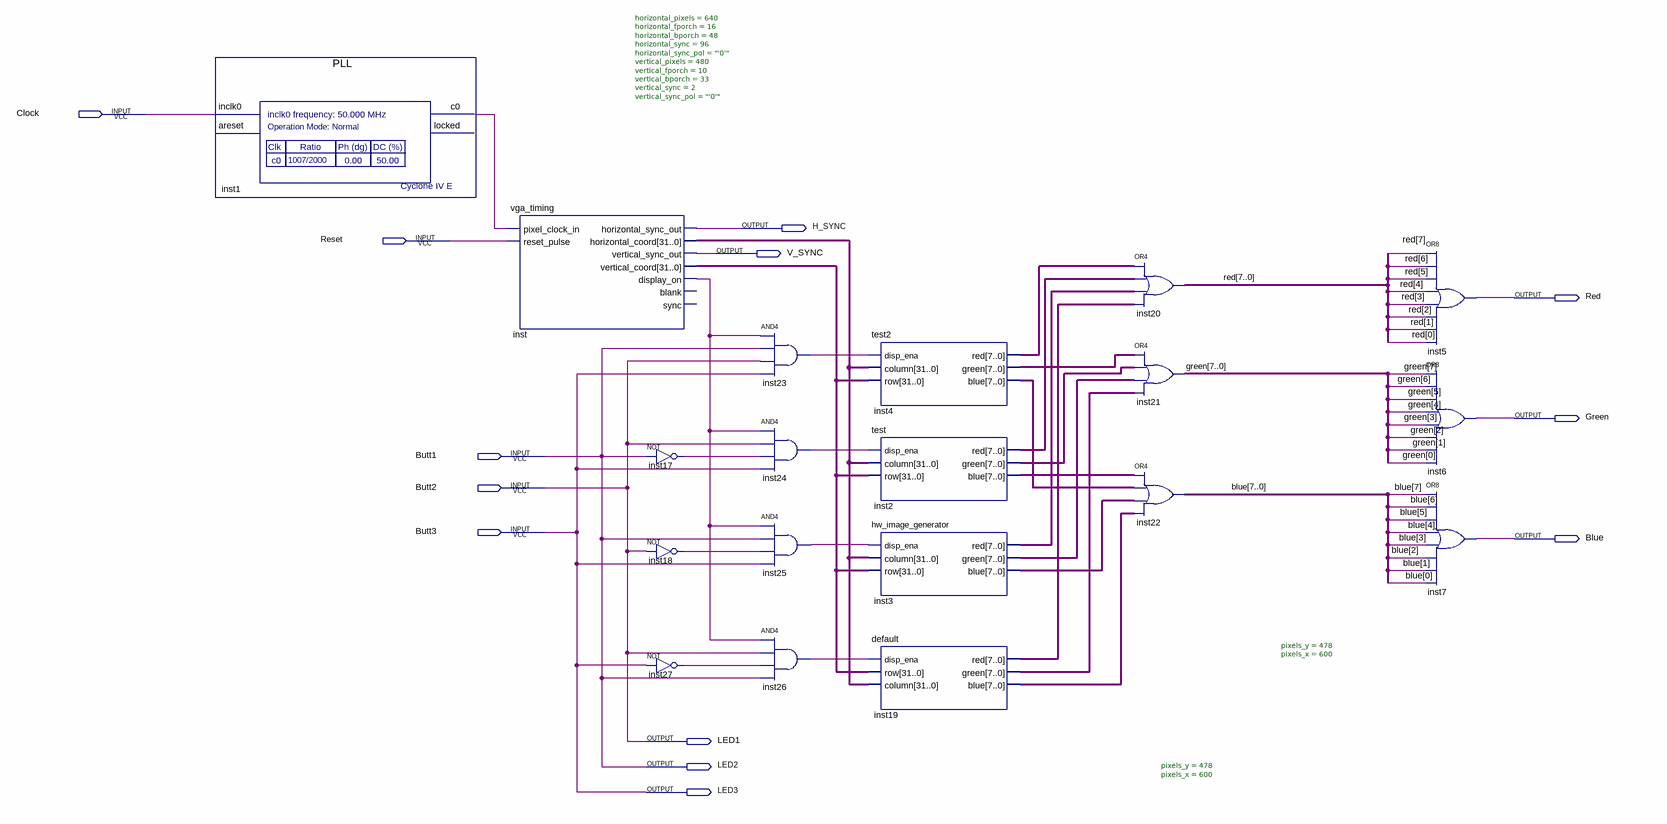
[diagram p0: schematic sheet]
// Quartus schematic VGA_CONTROLLER.bdf as structural Verilog: 19 symbols, 13 pins
module VGA_CONTROLLER (
  input  Clock,
  input  Reset,
  input  Butt1,
  input  Butt2,
  input  Butt3,
  output H_SYNC,
  output V_SYNC,
  output Red,
  output Green,
  output Blue,
  output LED1,
  output LED2,
  output LED3
);

  wire inst1_c0, inst17_out, inst18_out, inst23_out, inst24_out, inst25_out, inst26_out, inst27_out,
       inst_display_on;
  wire [7:0] Blue_bus, Green_bus, inst2_blue, inst2_green, inst2_red, inst3_blue, inst3_green, inst3_red,
       inst4_blue, inst4_green, inst4_red, inst19_blue, inst19_green, inst19_red, Red_bus;
  wire [31:0] inst_horizontal_coord, inst_vertical_coord;

  PLL inst1 (.inclk0(Clock), .c0(inst1_c0));  // open: areset, locked
  vga_timing #(.horizontal_pixels(640), .horizontal_fporch(16), .horizontal_bporch(48), .horizontal_sync(96), .horizontal_sync_pol("'0'"), .vertical_pixels(480), .vertical_fporch(10), .vertical_bporch(33), .vertical_sync(2), .vertical_sync_pol("'0'")) inst (
    .pixel_clock_in(inst1_c0), .reset_pulse(Reset), .horizontal_sync_out(H_SYNC),
    .horizontal_coord(inst_horizontal_coord), .vertical_sync_out(V_SYNC),
    .vertical_coord(inst_vertical_coord), .display_on(inst_display_on));  // open: blank, sync
  not inst17 (inst17_out, Butt1);
  not inst18 (inst18_out, Butt2);
  not inst27 (inst27_out, Butt3);
  and inst23 (inst23_out, inst_display_on, Butt1, Butt2, Butt3);
  and inst24 (inst24_out, inst_display_on, Butt2, inst17_out, Butt3);
  and inst25 (inst25_out, inst_display_on, Butt1, inst18_out, Butt3);
  and inst26 (inst26_out, inst_display_on, Butt2, inst27_out, Butt1);
  test2 inst4 (
    .disp_ena(inst23_out), .row(inst_vertical_coord), .column(inst_horizontal_coord), .red(inst4_red),
    .green(inst4_green), .blue(inst4_blue));
  test inst2 (
    .disp_ena(inst24_out), .row(inst_vertical_coord), .column(inst_horizontal_coord), .red(inst2_red),
    .green(inst2_green), .blue(inst2_blue));
  hw_image_generator #(.pixels_y(478), .pixels_x(600)) inst3 (
    .disp_ena(inst25_out), .row(inst_vertical_coord), .column(inst_horizontal_coord), .red(inst3_red),
    .green(inst3_green), .blue(inst3_blue));
  \default  #(.pixels_y(478), .pixels_x(600)) inst19 (
    .disp_ena(inst26_out), .row(inst_vertical_coord), .column(inst_horizontal_coord), .red(inst19_red),
    .green(inst19_green), .blue(inst19_blue));
  assign Red_bus = inst4_red | inst2_red | inst3_red | inst19_red;  // OR4 inst20, 8 bits wide
  assign Green_bus = inst4_green | inst2_green | inst3_green | inst19_green;  // OR4 inst21, 8 bits wide
  assign Blue_bus = inst2_blue | inst4_blue | inst3_blue | inst19_blue;  // OR4 inst22, 8 bits wide
  or inst5 (Red, Red_bus[7], Red_bus[6], Red_bus[5], Red_bus[4], Red_bus[3], Red_bus[2], Red_bus[1], Red_bus[0]);
  or inst6 (Green, Green_bus[7], Green_bus[6], Green_bus[5], Green_bus[4], Green_bus[3], Green_bus[2], Green_bus[1], Green_bus[0]);
  or inst7 (Blue, Blue_bus[7], Blue_bus[6], Blue_bus[5], Blue_bus[4], Blue_bus[3], Blue_bus[2], Blue_bus[1], Blue_bus[0]);

  assign LED1 = Butt2;
  assign LED2 = Butt1;
  assign LED3 = Butt3;
endmodule
